# EAGLE schematic 9volt_rail (EAGLE 7.0.0)
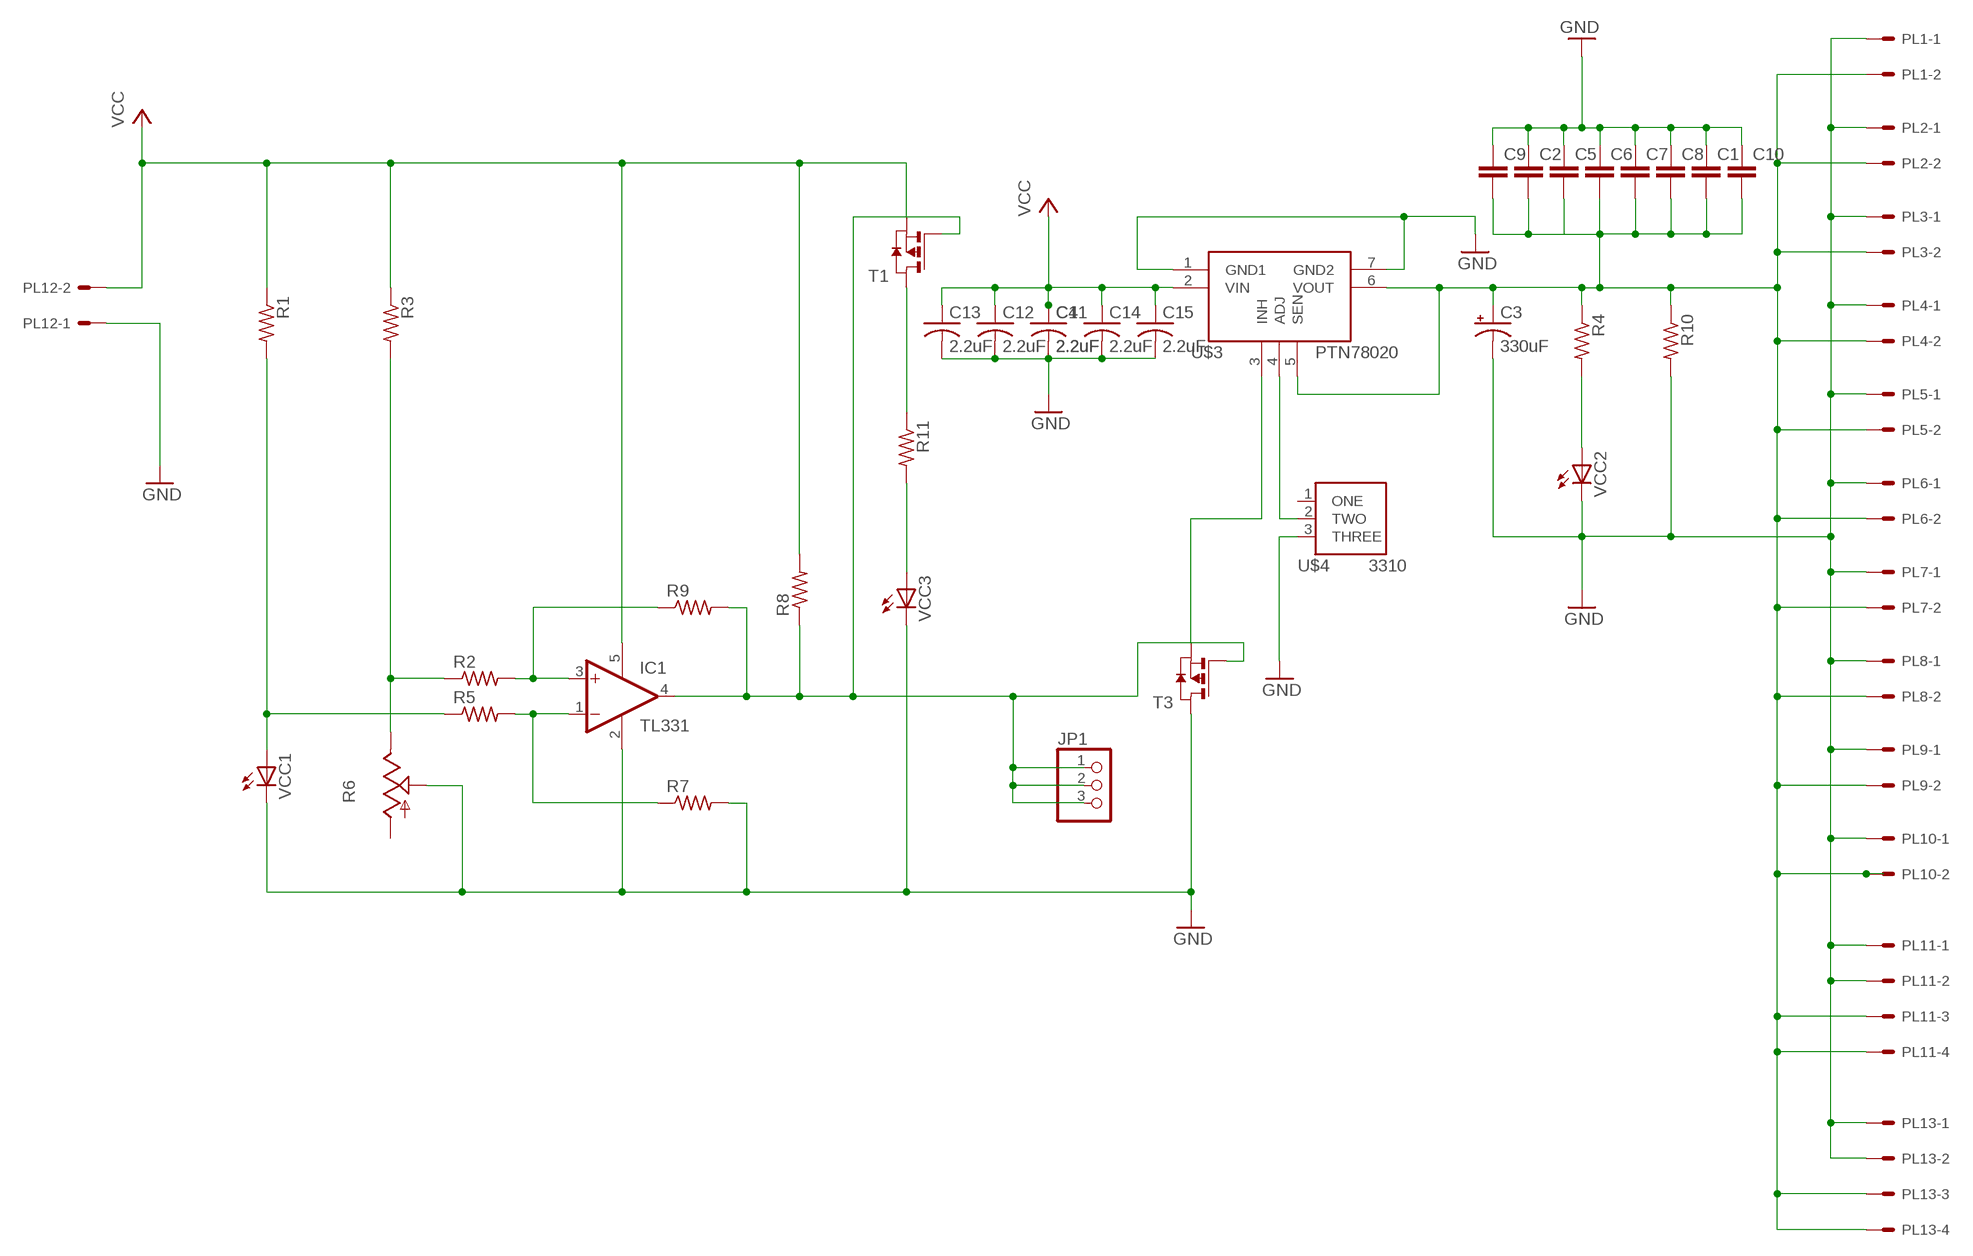
[diagram p0: schematic, sheet 1]

## Parts
C1  C-EUC0805  [C0805]
C2  C-EUC0805  [C0805]
C3  330uF  CPOL-USE5-10.5  [E5-10,5]
C4  2.2uF  C-USC0805  [C0805]
C5  C-EUC0805  [C0805]
C6  C-EUC0805  [C0805]
C7  C-EUC0805  [C0805]
C8  C-EUC0805  [C0805]
C9  C-EUC0805  [C0805]
C10  C-EUC0805  [C0805]
C11  2.2uF  C-USC0805  [C0805]
C12  2.2uF  C-USC0805  [C0805]
C13  2.2uF  C-USC0805  [C0805]
C14  2.2uF  C-USC0805  [C0805]
C15  2.2uF  C-USC0805  [C0805]
IC1  TL331  [DBV-R-PDSO-G5]
JP1  PINHD-1X3  [1X03]
PL1  555X-2H  [5569-2]
PL2  555X-2H  [5569-2]
PL3  555X-2H  [5569-2]
PL4  555X-2H  [5569-2]
PL5  555X-2H  [5569-2]
PL6  555X-2H  [5569-2]
PL7  555X-2H  [5569-2]
PL8  555X-2H  [5569-2]
PL9  555X-2H  [5569-2]
PL10  555X-2H  [5569-2]
PL11  555X-4H  [5569-4]
PL12  555X-2H  [5569-2]
PL13  555X-4H  [5569-4]
R1  R-US_M0805  [M0805]
R2  R-US_M0805  [M0805]
R3  R-US_M0805  [M0805]
R4  R-US_M0805  [M0805]
R5  R-US_M0805  [M0805]
R6  TRIM_US-RS3  [RS3]
R7  R-US_M0805  [M0805]
R8  R-US_M0805  [M0805]
R9  R-US_M0805  [M0805]
R10  R-US_M0805  [M0805]
R11  R-US_M0805  [M0805]
T1  PMOSSOT223  [SOT223]
T3  PMOSSOT223  [SOT223]
U$3  PTH78020-SMD  [PTN78020-SND]
U$4  3310-001  [3310-001-TH]
VCC1  LED5MM  [LED5MM]
VCC2  LED5MM  [LED5MM]
VCC3  LED5MM  [LED5MM]

## Nets
GND: C1.1 C2.1 C3.- C4.2 C5.1 C6.1 C7.1 C8.1 C9.1 C10.1 C11.2 C12.2 C13.2 C14.2 C15.2 IC1.2(GND) PL1.1 PL2.1 PL3.1 PL4.1 PL5.1 PL6.1 PL7.1 PL8.1 PL9.1 PL10.1 PL11.1 PL11.2 PL12.1 PL13.1 PL13.2 R6.S R7.2 R10.2 T3.2(D) T3.4(D) U$3.1(GND1) U$3.7(GND2) U$4.3(THREE) VCC1.K(C) VCC2.K(C) VCC3.K(C)
N$1: C1.2 C2.2 C3.+ C5.2 C6.2 C7.2 C8.2 C9.2 C10.2 PL1.2 PL2.2 PL3.2 PL4.2 PL5.2 PL6.2 PL7.2 PL8.2 PL9.2 PL10.2 PL11.3 PL11.4 PL13.3 PL13.4 R4.1 R10.1 U$3.5(SEN) U$3.6(VOUT)
N$2: IC1.4(OUT) JP1.1 JP1.2 JP1.3 R8.1 R9.2 T1.1(G) T3.1(G)
N$3: R1.2 R5.1 VCC1.A
N$4: IC1.3(+IN) R2.2 R9.1
N$5: T3.3(S) U$3.3(INH)
N$6: R2.1 R3.2 R6.E
N$7: IC1.1(-IN) R5.2 R7.1
N$8: R11.2 VCC3.A
N$9: R4.2 VCC2.A
N$10: R11.1 T1.2(D) T1.4(D)
N$12: U$3.4(ADJ) U$4.2(TWO)
VCC: C4.1 C11.1 C12.1 C13.1 C14.1 C15.1 IC1.5(V+) PL12.2 R1.1 R3.1 R8.2 T1.3(S) U$3.2(VIN)
Unconnected: R6.A U$4.1(ONE)

## Library data of the parts
C1 C2 C5-C10 = rcl:C-EU: CAPACITOR, European symbol
C3 = rcl:CPOL-US: POLARIZED CAPACITOR, American symbol
C4 C11-C15 = adafruit:C-US: CAPACITOR, American symbol
IC1 = linear:TL331: SINGLE DIFFERENTIAL COMPARATOR Source: Data sheet <http://www.ti.com/lit/ds/symlink/tl331-q1.pdf>
JP1 = adafruit:PINHD-1X3: PIN HEADER
PL1-PL10 PL12 = con-molex-2:555X-2: Mini FIT connector 2 way
PL11 PL13 = con-molex-2:555X-4: Mini FIT connector 4 way
R1-R5 R7-R11 = adafruit:R-US_: RESISTOR, American symbol
R6 = pot:TRIM_US-: POTENTIOMETER
T1 T3 = zetex:PMOSSOT223: MOS FET; OC_FARNELL: unknown; OC_NEWARK: unknown
U$3 = PTN78020:PTH78020-SMD
U$4 = 3310-001:3310-001
VCC1-VCC3 = adafruit:LED: LED OSRAM: - CHIPLED LG R971, LG N971, LY N971, LG Q971, LY Q971, LO R971, LY R971 LH N974, LH R974 LS Q976, LO Q976, LY Q976 LO Q996 - Hyper CHIPLED LW Q18S LB Q993, LB Q99A, LB R99A - SideLED LS A670, LO A670, LY A670, LG A670, LP A670 LB A673, LV A673, LT A673, LW A673 LH A674 LY A675 LS A676, LA A676, LO A676, LY A676, LW A676 LS A679, LY A679, LG A679 - Hyper Micro SIDELED® LS Y876, LA Y876, LO Y876, LY Y876 LT Y87S - SmartLED LW L88C, LW L88S LB L89C, LB L89S, LG L890 LS L89K, LO L89K, LY L89K LS L896, LA L896, LO L896, LY L896 - TOPLED LS T670, LO T670, LY T670, LG T670, LP T670 LSG T670, LSP T670, LSY T670, LOP T670, LYG T670 LG T671, LOG T671, LSG T671 LB T673, LV T673, LT T673, LW T673 LH T674 LS T676, LA T676, LO T676, LY T676, LB T676, LH T676, LSB T676, LW T676 LB T67C, LV T67C, LT T67C, LS T67K, LO T67K, LY T67K, LW E67C LS E67B, LA E67B, LO E67B, LY E67B, LB E67C, LV E67C, LT E67C LW T67C LS T679, LY T679, LG T679 LS T770, LO T770, LY T770, LG T770, LP T770 LB T773, LV T773, LT T773, LW T773 LH T774 LS E675, LA E675, LY E675, LS T675 LS T776, LA T776, LO T776, LY T776, LB T776 LHGB T686 LT T68C, LB T68C - Hyper Mini TOPLED® LB M676 - Mini TOPLED Santana® LG M470 LS M47K, LO M47K, LY M47K Source: http://www.osram.convergy.de/

## Net classes
0 default: width 2.54 mm, drill 0.508 mm, clearance 0.254 mm